# Altium schematic sheet KV2_MotionA12.SchDoc
size A3; PageSetup: Record=PageOptions|CenterHorizontal=True|CenterVertical=True|PrintScale=1.00|XCorrection=1.00|YCorrection=1.00|PrintKind=2|BorderSize=5000000|LeftOffset=0|BottomOffset=0|Orientation=2|PaperLength=1000|PaperWidth=1000|Scale=100|PaperSource=7|PrintQuality=-4|MediaType=1|DitherType=10|PaperKind=A3|PrintScaleMode=1
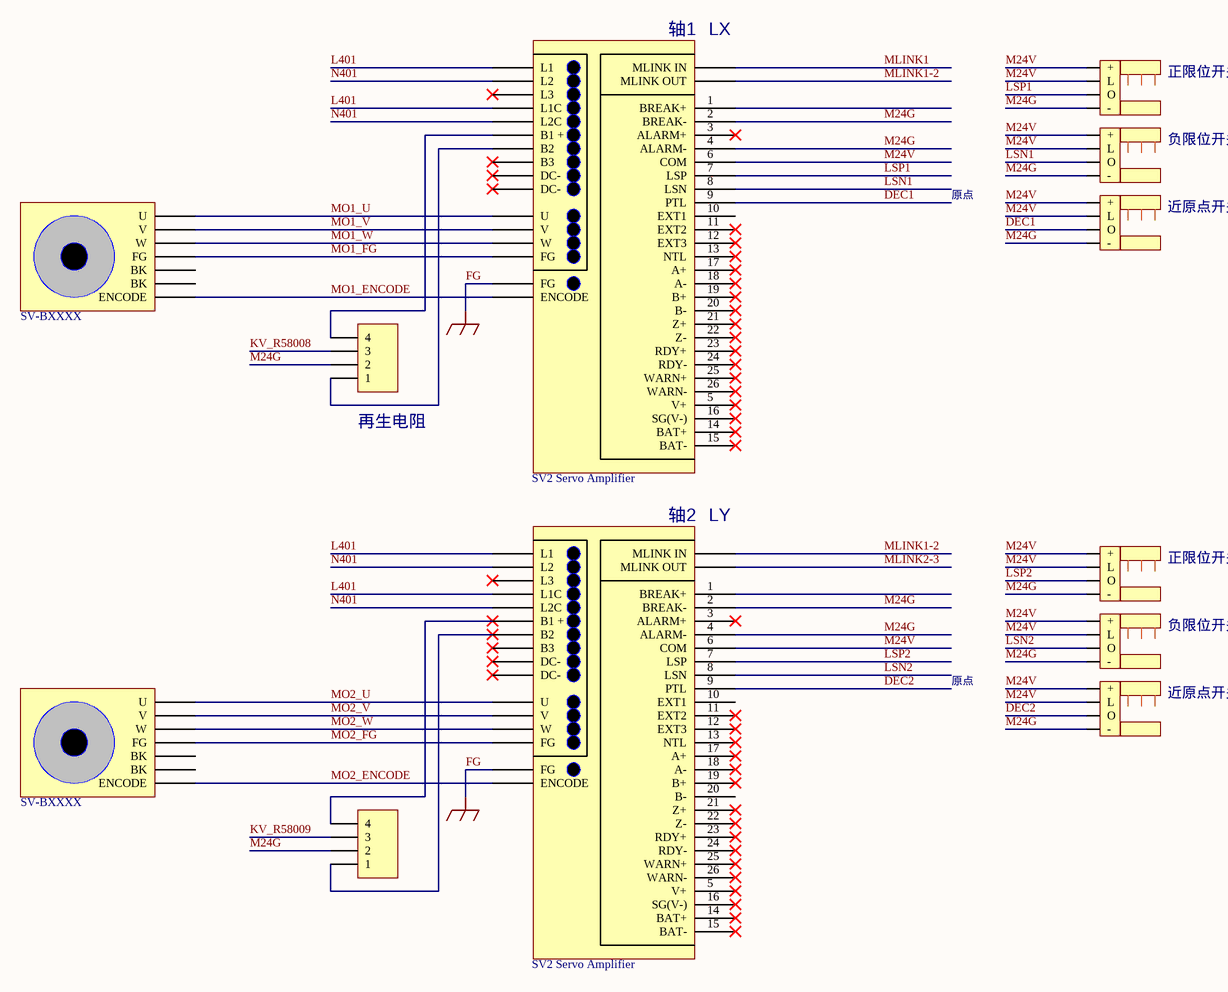
[diagram p0: KV2_MotionA12.SchDoc]

## Parts
(Parts that share a designator on the sheet are numbered #1, #2 ... from top to bottom, then left to right.)
*#1  SV2 Servo Amplifier
*#2  SV-BXXXX
*#3  SV2 Servo Amplifier
*#4  SV-BXXXX
P?#1  Header 4  [HDR1X4]  (value not drawn)
P?#2  Header 4  [HDR1X4]  (value not drawn)
原点光纤传感器#1  OMRON  E3X-HD  (value not drawn)
原点光纤传感器#2  OMRON  E3X-HD  (value not drawn)
原点光纤传感器#3  OMRON  E3X-HD  (value not drawn)
原点光纤传感器#4  OMRON  E3X-HD  (value not drawn)
原点光纤传感器#5  OMRON  E3X-HD  (value not drawn)
原点光纤传感器#6  OMRON  E3X-HD  (value not drawn)

## Nets
FG: *#1.X43(FG) *#3.X43(FG)  [also labelled GND]
DEC1: *#1.9(PTL) 原点光纤传感器#3.91(O)
DEC2: *#3.9(PTL) 原点光纤传感器#6.91(O)
KV_R58008: P?#1.3
KV_R58009: P?#2.3
L401: *#1.X34(L1) *#1.X37(L1C) *#3.X34(L1) *#3.X37(L1C)
LSN1: *#1.8(LSN) 原点光纤传感器#2.91(O)
LSN2: *#3.8(LSN) 原点光纤传感器#5.91(O)
LSP1: *#1.7(LSP) 原点光纤传感器#1.91(O)
LSP2: *#3.7(LSP) 原点光纤传感器#4.91(O)
M24G: *#1.2(BREAK-) *#1.4(ALARM-) *#3.2(BREAK-) *#3.4(ALARM-) P?#1.2 P?#2.2 原点光纤传感器#1.92(-) 原点光纤传感器#2.92(-) 原点光纤传感器#3.92(-) 原点光纤传感器#4.92(-) 原点光纤传感器#5.92(-) 原点光纤传感器#6.92(-)
M24V: *#1.6(COM) *#3.6(COM) 原点光纤传感器#1.89(+) 原点光纤传感器#1.90(L) 原点光纤传感器#2.89(+) 原点光纤传感器#2.90(L) 原点光纤传感器#3.89(+) 原点光纤传感器#3.90(L) 原点光纤传感器#4.89(+) 原点光纤传感器#4.90(L) 原点光纤传感器#5.89(+) 原点光纤传感器#5.90(L) 原点光纤传感器#6.89(+) 原点光纤传感器#6.90(L)
MLINK1: *#1.X44(MLINK_IN)
MLINK1-2: *#1.X44(MLINK_OUT) *#3.X44(MLINK_IN)
MLINK2-3: *#3.X44(MLINK_OUT)
MO1_ENCODE: *#1.X44(ENCODE) *#2.29(ENCODE)
MO1_FG: *#1.X43(FG) *#2.29(FG)
MO1_U: *#1.X43(DC-) *#2.27(U)
MO1_V: *#1.X43(V) *#2.28(V)
MO1_W: *#1.X43(W) *#2.29(W)
MO2_ENCODE: *#3.X44(ENCODE) *#4.29(ENCODE)
MO2_FG: *#3.X43(FG) *#4.29(FG)
MO2_U: *#3.X43(DC-) *#4.27(U)
MO2_V: *#3.X43(V) *#4.28(V)
MO2_W: *#3.X43(W) *#4.29(W)
N401: *#1.X35(L2) *#1.X38(L2C) *#3.X35(L2) *#3.X38(L2C)
Net*#1_X39: *#1.X39(B1_+) P?#1.4
Net*#1_X40: *#1.X40(B2) P?#1.1
Net*#3_X39: *#3.X39(B1_+) P?#2.4
Net*#3_X40: *#3.X40(B2) P?#2.1

Not connected (* = marked no-connect by the designer): *#1 1(BREAK+) 3(ALARM+)* 5(V+)* 10(EXT1) 11(EXT2)* 12(EXT3)* 13(NTL)* 14(BAT+)* 15(BAT-)* 16(SG(V-))* 17(A+)* 18(A-)* 19(B+)* 20(B-)* 21(Z+)* 22(Z-)* 23(RDY+)* 24(RDY-)* 25(WARN+)* 26(WARN-)* X36(L3)* X41(B3)* X42(DC-)*; *#2 30(BK) 31(BK); *#3 1(BREAK+) 3(ALARM+)* 5(V+)* 10(EXT1) 11(EXT2)* 12(EXT3)* 13(NTL)* 14(BAT+)* 15(BAT-)* 16(SG(V-))* 17(A+)* 18(A-)* 19(B+)* 20(B-) 21(Z+)* 22(Z-)* 23(RDY+)* 24(RDY-)* 25(WARN+)* 26(WARN-)* X36(L3)* X41(B3)* X42(DC-)*; *#4 30(BK) 31(BK)

## Notes on the sheet
- (near *#1) 轴1
- (near *#1) LX
- 正限位开关
- 负限位开关
- 原点
- 近原点开关
- (near P?#1) 再生电阻
- (near *#3) 轴2
- (near *#3) LY

## Library data of the parts
P?#1 P?#2 = Header 4: Header, 4-Pin; LatestRevisionDate: 17-Jul-2002; LatestRevisionNote: Re-released for DXP Platform.; Publisher: Altium Limited
原点光纤传感器#1-原点光纤传感器#6 = OMRON_EE-SX671